# Altium project epm3128.PrjPCB
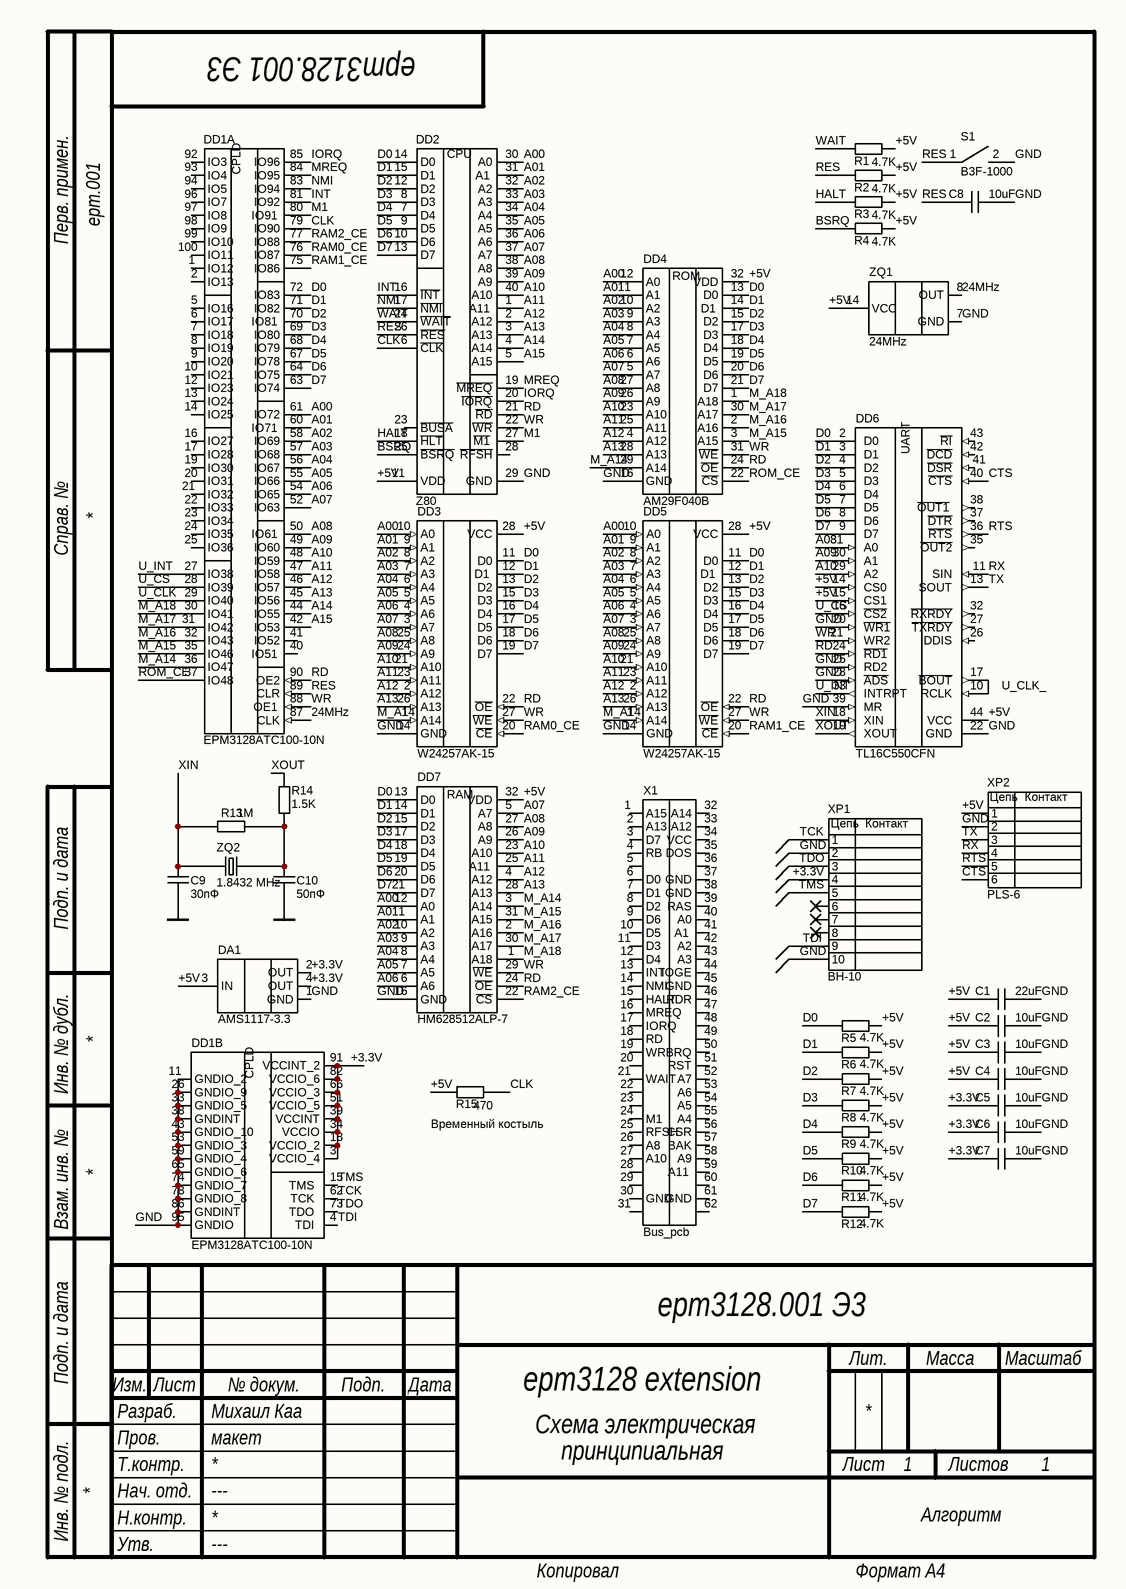
[diagram p0: main.SchDoc]
1 sheet, 39 parts. Net scope: global (net labels, ports and power ports of the same name join across sheets).
Board file: pcb.PcbDoc

## Sheet main.SchDoc
size 209 x 297 mm; Address1: Address1; Address2: Address2; Address3: Address3; Address4: Address4; SheetNumber: 1; SheetTotal: 1; Scale: 1:1; Разраб.: Михаил Каа; Обозначение документа: epm3128.001 Э3; Пров.: макет; Утв.: ---; Номер листа: 1; Общее количество листов: 1; Наименование организации: Алгоритм; Перв. применение: epm.001; Наименование изделия 1: epm3128 extension; Наименование изделия 2: Схема электрическая; Наименование изделия 3: принципиальная; Нач. отд.: Нач. отд.; Фамилия нач. отд.: ---

### Parts
C1  22uF  [С1206]
C2  10uF  [C0805]
C3  10uF  [C0805]
C4  10uF  [C0805]
C5  10uF  [C0805]
C6  10uF  [C0805]
C7  10uF  [C0805]
C8  10uF  [C0805]
C9  30пФ  [C0805]
C10  50пФ  [C0805]
DA1  AMS1117-3.3  [SOT229P700X180-4N]
DD1  EPM3128ATC100-10N  [tqfp100_on_proto_board]  (parts A,B of 2)
DD2  Z80  [DIP1540W47P254L5320H635Q40B]
DD3  W24257AK-15  [DIP28_300mil_socket]
DD4  AM29F040B  [DIP254P1524X482-32]
DD5  W24257AK-15  [DIP28_300mil_socket]
DD6  TL16C550CFN  [PLCC-44-R]
DD7  HM628512ALP-7  [DIP254P1524X482-32]
R1  4.7K  [R0603]
R2  4.7K  [R0603]
R3  4.7K  [R0603]
R4  4.7K  [R0805]
R5  4.7K  [R0603]
R6  4.7K  [R0603]
R7  4.7K  [R0603]
R8  4.7K  [R0603]
R9  4.7K  [R0603]
R10  4.7K  [R0603]
R11  4.7K  [R0603]
R12  4.7K  [R0603]
R13  1M  [R0805]
R14  1.5K  [R0805]
R15  470  [R0603]
S1  B3F-1000  [SW_B3F-1000]
X1  Bus_pcb  [BUS]
XP1  BH-10  [BH-10]
XP2  PLS-6  [6pin]
ZQ1  24MHz  [OSC_ECS-100A-240]
ZQ2  1.8432 MHz  [XTAL_HC-49U]

### Nets
GND: C1.2 C2.2 C3.2 C4.2 C5.2 C6.2 C7.2 C8.2 C9.1 C10.1 DA1.1(GND) DD1.11(GNDIO_2) DD1.26(GNDIO_9) DD1.33(GNDIO_5) DD1.38(GNDINT) DD1.43(GNDIO_10) DD1.53(GNDIO_3) DD1.59(GNDIO_4) DD1.65(GNDIO_6) DD1.74(GNDIO_7) DD1.78(GNDIO_8) DD1.86(GNDINT) DD1.95(GNDIO) DD2.29(GND) DD3.14(GND) DD4.16(GND) DD5.14(GND) DD6.20(~{WR1}) DD6.22(GND) DD6.25(RD2) DD6.28(~{ADS}) DD6.39(MR) DD7.16(GND) S1.2 XP1.2 XP1.10 XP2.2 ZQ1.7(GND)
24MHz: DD1.87(CLK) ZQ1.8(OUT)
+3.3V: C5.1 C6.1 C7.1 DA1.2(OUT) DA1.4(OUT) DD1.3(VCCIO_4) DD1.18(VCCIO_2) DD1.34(VCCIO) DD1.39(VCCINT) DD1.51(VCCIO_5) DD1.66(VCCIO_3) DD1.82(VCCIO_6) DD1.91(VCCINT_2) XP1.4
+5V: C1.1 C2.1 C3.1 C4.1 DA1.3(IN) DD2.11(VDD) DD3.28(VCC) DD4.32(VDD) DD5.28(VCC) DD6.14(CS0) DD6.15(CS1) DD6.44(VCC) DD7.32(VDD) R1.2 R2.2 R3.2 R4.2 R5.2 R6.2 R7.2 R8.2 R9.2 R10.2 R11.2 R12.2 R15.1 XP2.1 ZQ1.14(VCC)
A00: DD1.61(IO72) DD2.30(A0) DD3.10(A0) DD4.12(A0) DD5.10(A0) DD7.12(A0)
A01: DD1.60(IO71) DD2.31(A1) DD3.9(A1) DD4.11(A1) DD5.9(A1) DD7.11(A1)
A02: DD1.58(IO69) DD2.32(A2) DD3.8(A2) DD4.10(A2) DD5.8(A2) DD7.10(A2)
A03: DD1.57(IO68) DD2.33(A3) DD3.7(A3) DD4.9(A3) DD5.7(A3) DD7.9(A3)
A04: DD1.56(IO67) DD2.34(A4) DD3.6(A4) DD4.8(A4) DD5.6(A4) DD7.8(A4)
A05: DD1.55(IO66) DD2.35(A5) DD3.5(A5) DD4.7(A5) DD5.5(A5) DD7.7(A5)
A06: DD1.54(IO65) DD2.36(A6) DD3.4(A6) DD4.6(A6) DD5.4(A6) DD7.6(A6)
A07: DD1.52(IO63) DD2.37(A7) DD3.3(A7) DD4.5(A7) DD5.3(A7) DD7.5(A7)
A08: DD1.50(IO61) DD2.38(A8) DD3.25(A8) DD4.27(A8) DD5.25(A8) DD6.31(A0) DD7.27(A8)
A09: DD1.49(IO60) DD2.39(A9) DD3.24(A9) DD4.26(A9) DD5.24(A9) DD6.30(A1) DD7.26(A9)
A10: DD1.48(IO59) DD2.40(A10) DD3.21(A10) DD4.23(A10) DD5.21(A10) DD6.29(A2) DD7.23(A10)
A11: DD1.47(IO58) DD2.1(A11) DD3.23(A11) DD4.25(A11) DD5.23(A11) DD7.25(A11)
A12: DD1.46(IO57) DD2.2(A12) DD3.2(A12) DD4.4(A12) DD5.2(A12) DD7.4(A12)
A13: DD1.45(IO56) DD2.3(A13) DD3.26(A13) DD4.28(A13) DD5.26(A13) DD7.28(A13)
A14: DD1.44(IO55) DD2.4(A14)
A15: DD1.42(IO53) DD2.5(A15)
BSRQ: DD2.25(~{BSRQ}) R4.1
CLK: DD1.79(IO90) DD2.6(~{CLK}) R15.2
CTS: DD6.40(~{CTS}) XP2.6
D0: DD1.72(IO83) DD2.14(D0) DD3.11(D0) DD4.13(D0) DD5.11(D0) DD6.2(D0) DD7.13(D0) R5.1
D1: DD1.71(IO82) DD2.15(D1) DD3.12(D1) DD4.14(D1) DD5.12(D1) DD6.3(D1) DD7.14(D1) R6.1
D2: DD1.70(IO81) DD2.12(D2) DD3.13(D2) DD4.15(D2) DD5.13(D2) DD6.4(D2) DD7.15(D2) R7.1
D3: DD1.69(IO80) DD2.8(D3) DD3.15(D3) DD4.17(D3) DD5.15(D3) DD6.5(D3) DD7.17(D3) R8.1
D4: DD1.68(IO79) DD2.7(D4) DD3.16(D4) DD4.18(D4) DD5.16(D4) DD6.6(D4) DD7.18(D4) R9.1
D5: DD1.67(IO78) DD2.9(D5) DD3.17(D5) DD4.19(D5) DD5.17(D5) DD6.7(D5) DD7.19(D5) R10.1
D6: DD1.64(IO75) DD2.10(D6) DD3.18(D6) DD4.20(D6) DD5.18(D6) DD6.8(D6) DD7.20(D6) R11.1
D7: DD1.63(IO74) DD2.13(D7) DD3.19(D7) DD4.21(D7) DD5.19(D7) DD6.9(D7) DD7.21(D7) R12.1
HALT: DD2.18(~{HLT}) R3.1
INT: DD1.81(IO92) DD2.16(~{INT})
IORQ: DD1.85(IO96) DD2.20(~{IORQ})
M1: DD1.80(IO91) DD2.27(~{M1})
M_A14: DD1.36(IO47) DD3.1(A14) DD4.29(A14) DD5.1(A14) DD7.3(A14)
M_A15: DD1.35(IO46) DD4.3(A15) DD7.31(A15)
M_A16: DD1.32(IO43) DD4.2(A16) DD7.2(A16)
M_A17: DD1.31(IO42) DD4.30(A17) DD7.30(A17)
M_A18: DD1.30(IO41) DD4.1(A18) DD7.1(A18)
MREQ: DD1.84(IO95) DD2.19(~{MREQ})
NMI: DD1.83(IO94) DD2.17(~{NMI})
RAM0_CE: DD1.76(IO87) DD3.20(~{CE})
RAM1_CE: DD1.75(IO86) DD5.20(~{CE})
RAM2_CE: DD1.77(IO88) DD7.22(~{CS})
RD: DD1.90(OE2) DD2.21(~{RD}) DD3.22(~{OE}) DD4.24(~{OE}) DD5.22(~{OE}) DD6.24(~{RD1}) DD7.24(~{OE})
RES: C8.1 DD1.89(CLR) DD2.26(~{RES}) R2.1 S1.1
ROM_CE: DD1.37(IO48) DD4.22(~{CS})
RTS: DD6.36(~{RTS}) XP2.5
RX: DD6.11(SIN) XP2.4
TCK: DD1.62(TCK) XP1.1
TDI: DD1.4(TDI) XP1.9
TDO: DD1.73(TDO) XP1.3
TMS: DD1.15(TMS) XP1.5
TX: DD6.13(SOUT) XP2.3
U_CLK: DD1.29(IO40)
U_CS: DD1.28(IO39) DD6.16(~{CS2})
U_INT: DD1.27(IO38) DD6.33(INTRPT)
WAIT: DD2.24(~{WAIT}) R1.1
WR: DD1.88(OE1) DD2.22(~{WR}) DD3.27(~{WE}) DD4.31(~{WE}) DD5.27(~{WE}) DD6.21(WR2) DD7.29(~{WE})
XIN: C9.2 DD6.18(XIN) R13.1 ZQ2.1
XOUT: DD6.19(XOUT) R14.2
NetC10_2: C10.2 R13.2 R14.1 ZQ2.2
NetDD6_10: DD6.10(RCLK) DD6.17(~{BOUT})

Not connected (* = marked no-connect by the designer): DD1 1(IO12) 2(IO13) 5(IO16) 6(IO17) 7(IO18) 8(IO19) 9(IO20) 10(IO21) 12(IO23) 13(IO24) 14(IO25) 16(IO27) 17(IO28) 19(IO30) 20(IO31) 21(IO32) 22(IO33) 23(IO34) 24(IO35) 25(IO36) 40(IO51) 41(IO52) 92(IO3) 93(IO4) 94(IO5) 96(IO7) 97(IO8) 98(IO9) 99(IO10) 100(IO11); DD2 23(~{BUSA}) 28(~{RFSH}); DD6 1(NC_2) 12(NC_3) 23(NC_4) 26(DDIS) 27(~{TXRDY}) 32(~{RXRDY}) 34(NC) 35(~{OUT2}) 37(~{DTR}) 38(~{OUT1}) 41(~{DSR}) 42(~{DCD}) 43(~{RI}); X1 1(A15) 2(A13) 3(D7) 4(RB) 5 6(D0) 7(D1) 8(D2) 9(D6) 10(D5) 11(D3) 12(D4) 13(INT) 14(NMI) 15(HALT) 16(MREQ) 17(IORQ) 18(RD) 19(WR) 20 21(WAIT) 22 23 24(M1) 25(RFSH) 26(A8) 27(A10) 28 29 30(GND) 31 32(A14) 33(A12) 34(VCC) 35(DOS) 36 37(GND) 38(GND) 39(RAS) 40(A0) 41(A1) 42(A2) 43(A3) 44(IOGE) 45(GND) 46(RDR) 47 48 49 50(BRQ) 51(RST) 52(A7) 53(A6) 54(A5) 55(A4) 56(CSR) 57(BAK) 58(A9) 59(A11) 60 61(GND) 62; XP1 6* 7* 8*

### Notes on the sheet
- (near R15) Временный костыль
- Labels drawn without touching a wire or pin: U_CLK_
- Перв. примен.
- Справ. №
- Подп. и дата
- Инв. № дубл.
- Взам. инв. №
- Разраб.
- Изм.
- Лист
- № докум.
- Подп.
- Дата
- Лит.
- Масса
- Масштаб
- Пров.
- Т.контр.
- Листов
- Инв. № подл.
- Утв.
- Н.контр.
- Копировал
- Формат А4
- (in symbol AM29F040B) ROM
- (in symbol BH-10) Цепь; Контакт
- (in symbol EPM3128ATC100-10N, part A) CPLD
- (in symbol EPM3128ATC100-10N, part B) CPLD
- (in symbol HM628512ALP-7) RAM
- (in symbol PLS-6) Цепь; Контакт
- (in symbol TL16C550CFN) UART
- (in symbol Z80) CPU

### Library data of the parts
C1-C10 = CapCer
DD1 = EPM3128ATC100-10N: 100-Pin QFP; Package: None; Price: None; Value: *; MP: EPM3128ATC100-10N; Availability: Unavailable
DD3 DD5 = W24257AK-15: 32Kx8 Fast Static RAM; Value: *
DD6 = TL16C550CFN: ASYNCHRONOUS COMMUNICATIONS ELEMENT; Package: None; Price: None; Value: *; MP: TL16C550CFN; Availability: Unavailable
DD7 = HM628512ALP-7: 512Kx8 Static RAM
R1-R15 = Res
S1 = B3F-1000: pin to pad: 1>1+2 2>4+3; ChipDip PN: 8001787102; Platan PN: 2011347247
XP1 = BH-10: 10 Position Total Dual Row 2.54 mm Pitch Straight Male Shrouded Box Header; MF: Sullins Connector; MP: SBH11-PBPC-D05-ST-BK; SnapEDA_Link: https://www.snapeda.com/parts/SBH11-PBPC-D05-ST-BK/Sullins+Connector+Solutions/view-part/?ref=snap; Package: None; Value: *; Check_prices: https://www.snapeda.com/parts/SBH11-PBPC-D05-ST-BK/Sullins+Connector+Solutions/view-part/?ref=eda
ZQ1 = ECS-100A-240: Oscillator  14-DIP, 4 Leads (Full Size, Metal Can); Package: None; Price: None; Value: *; MP: ECS-100A-240; Availability: Unavailable
ZQ2 = HC-49U_1.8432